# Altium schematic sheet Double Buffer.SchDoc
size A; Organization: Cal Poly Racing; engineer1: who?
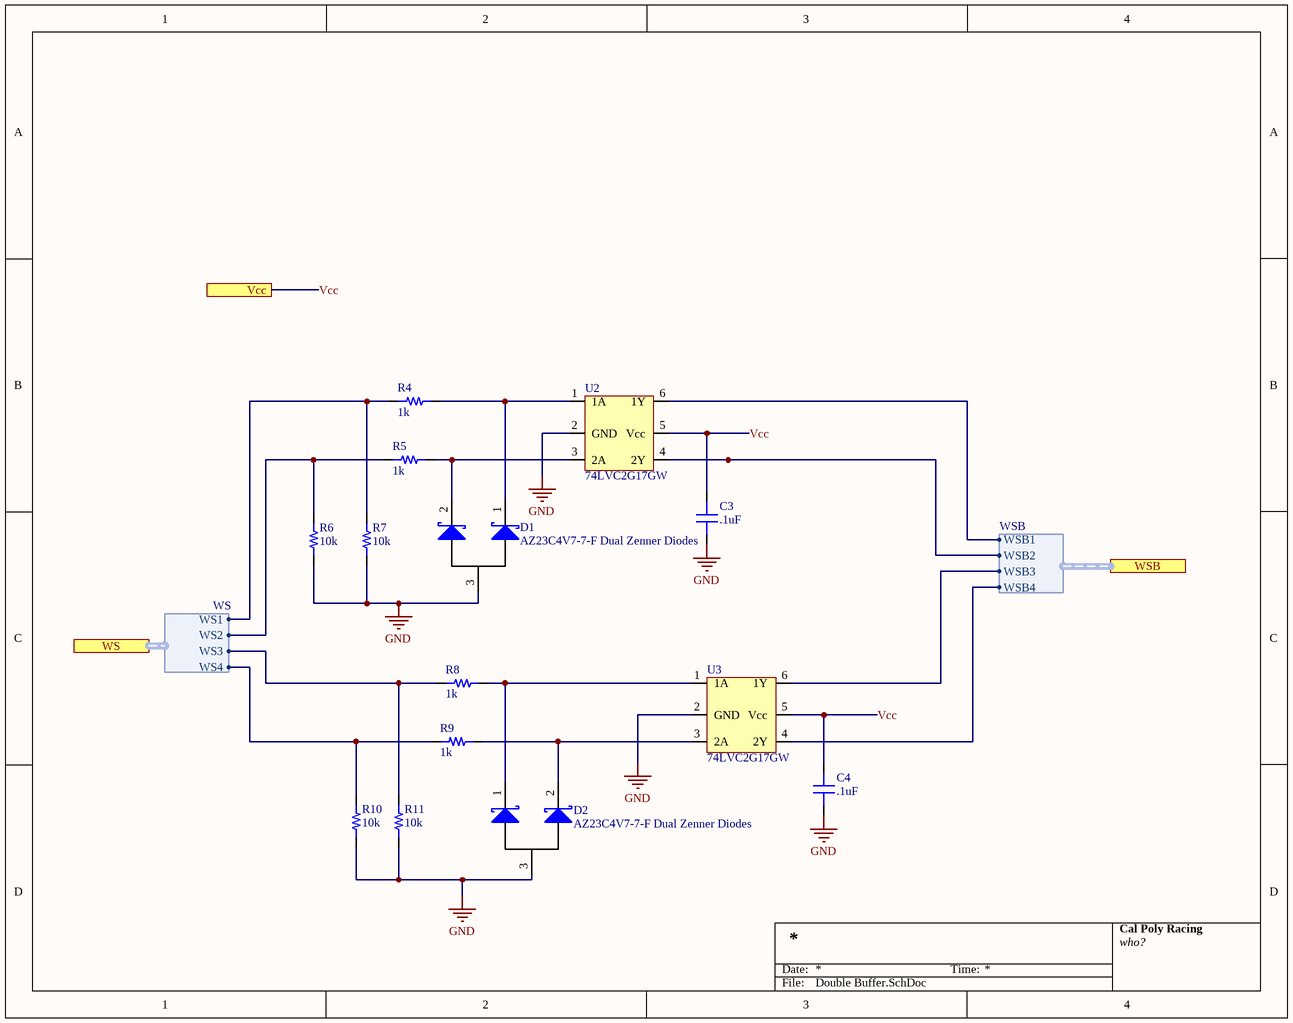
[diagram p0: Double Buffer.SchDoc]

## Parts
C3  capacitance: .1uF  [0603]  (hidden comment: capacitor)
C4  capacitance: .1uF  [0603]  (hidden comment: capacitor)
D1  AZ23C4V7-7-F Dual Zenner Diodes  [SOT23-3]
D2  AZ23C4V7-7-F Dual Zenner Diodes  [SOT23-3]
R4  1k  [RES 0603/1608]
R5  1k  [RES 0603/1608]
R6  10k  [RES 0603/1608]
R7  10k  [RES 0603/1608]
R8  1k  [RES 0603/1608]
R9  1k  [RES 0603/1608]
R10  10k  [RES 0603/1608]
R11  10k  [RES 0603/1608]
U2  74LVC2G17GW  [TSOP95P280X110-6N]
U3  74LVC2G17GW  [TSOP95P280X110-6N]

## Ports
Vcc, WS (harness WS), WSB (harness WSB)

## Harnesses
WS: WS1, WS2, WS3, WS4
WSB: WSB1, WSB2, WSB3, WSB4

## Nets
GND: C3.1 C4.1 D1.3 D2.3 R6.1 R7.1 R10.1 R11.1 U2.2(GND) U3.2(GND)
Vcc: C3.2 C4.2 U2.5(Vcc) U3.5(Vcc) ; port Vcc
NetD1_1: D1.1 R4.2 U2.1(1A)
NetD1_2: D1.2 R5.2 U2.3(2A)
NetD2_1: D2.1 R8.2 U3.1(1A)
NetD2_2: D2.2 R9.2 U3.3(2A)
NetR4_1: R4.1 R7.2 ; port WS.WS1
NetR5_1: R5.1 R6.2 ; port WS.WS2
NetR8_1: R8.1 R11.2 ; port WS.WS3
NetR9_1: R9.1 R10.2 ; port WS.WS4
NetU2_4: U2.4(2Y) ; port WSB.WSB2
NetU2_6: U2.6(1Y) ; port WSB.WSB1
NetU3_4: U3.4(2Y) ; port WSB.WSB4
NetU3_6: U3.6(1Y) ; port WSB.WSB3

## Notes on the sheet
- Date:
- Time:
- File:

## Library data of the parts
C3 C4 = 1: Generic 0603 capacitor; id: 1; voltage: 50; dielectric: Ceramic; percent tolerance: 10; name: 0603 Capacitor; ESR: 1; package: 0603; quantity: 0
D1 D2 = 14: DIODE ZENER ARRAY 4.7V SOT23-3; id: 14; name: AZ23C4V7-7-F; package: SOT23-3; quantity: 0; link: https://www.digikey.com/product-detail/en/diodes-incorporated/AZ23C4V7-7-F/AZ23C4V7-FDICT-ND/815309
R4-R11 = 1: id: 1; name: 0603 Resistor; percent tolerance: 5; package: 0603; quantity: 0
  R4 R5 R8 R9: resistance: 1k
  R6 R7 R10 R11: resistance: 10k
U2 U3 = 17: Buffer, Non-Inverting 2 Element 1 Bit per Element Push-Pull Output 6-TSSOP; id: 17; vcc: 5; updatedby: Nolan; name: 74LVC2G17; type: buffer; package: SOT457; quantity: 0; createdby: Nolan; createddate: 10/16/2019 10:08:58 PM; updateddate: 10/16/2019 10:08:58 PM